# EAGLE schematic PCB2 (EAGLE 8.0.1)
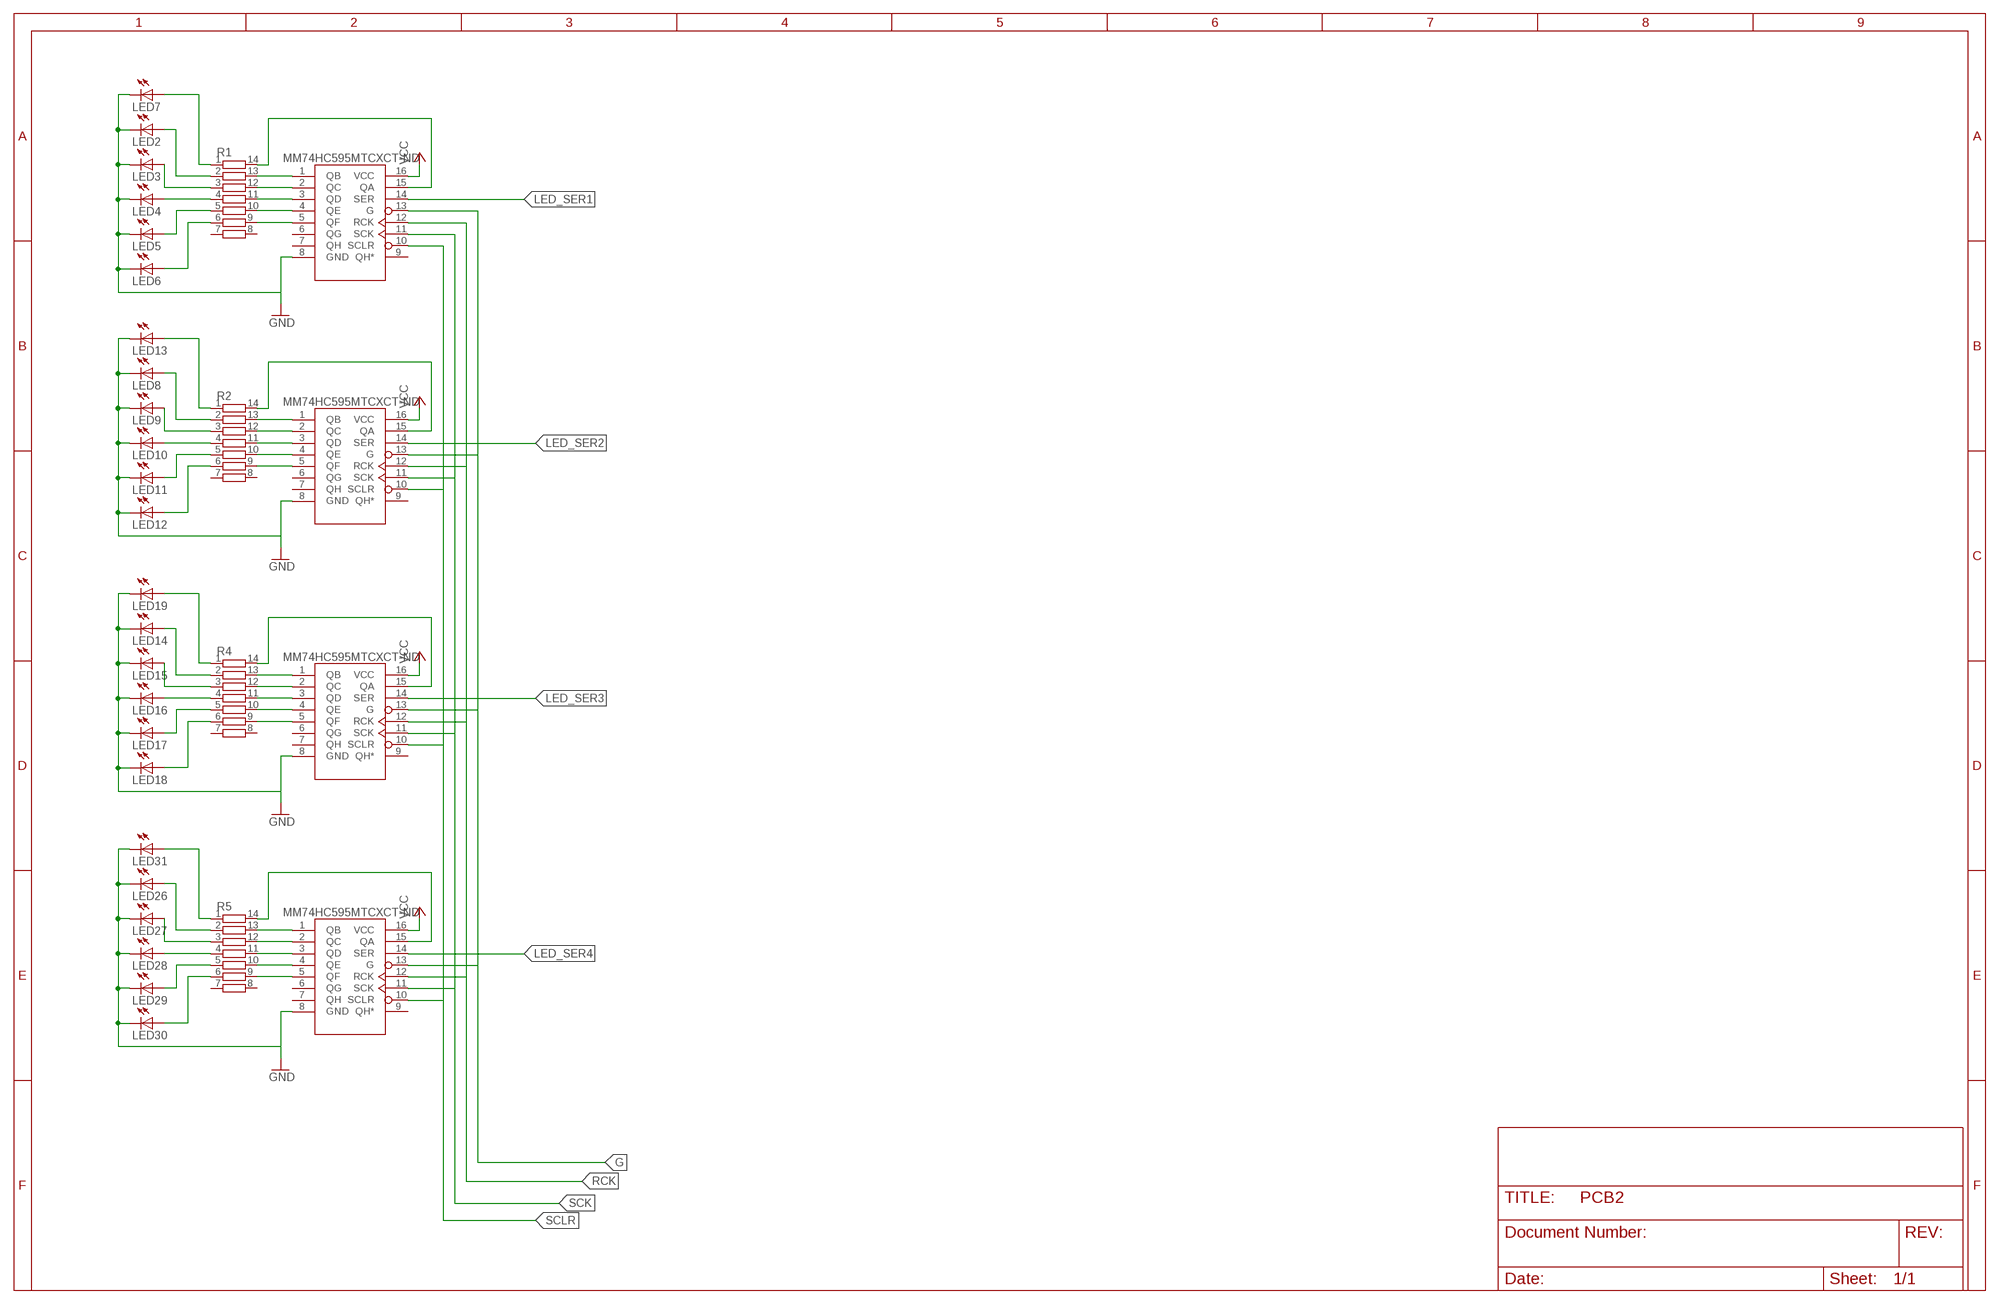
[diagram p0: schematic, sheet 1]

## Parts
LED2  LEDSMT1206  [1206]
LED3  LEDSMT1206  [1206]
LED4  LEDSMT1206  [1206]
LED5  LEDSMT1206  [1206]
LED6  LEDSMT1206  [1206]
LED7  LEDSMT1206  [1206]
LED8  LEDSMT1206  [1206]
LED9  LEDSMT1206  [1206]
LED10  LEDSMT1206  [1206]
LED11  LEDSMT1206  [1206]
LED12  LEDSMT1206  [1206]
LED13  LEDSMT1206  [1206]
LED14  LEDSMT1206  [1206]
LED15  LEDSMT1206  [1206]
LED16  LEDSMT1206  [1206]
LED17  LEDSMT1206  [1206]
LED18  LEDSMT1206  [1206]
LED19  LEDSMT1206  [1206]
LED26  LEDSMT1206  [1206]
LED27  LEDSMT1206  [1206]
LED28  LEDSMT1206  [1206]
LED29  LEDSMT1206  [1206]
LED30  LEDSMT1206  [1206]
LED31  LEDSMT1206  [1206]
R1  4814P-T01  [4814P]
R2  4814P-T01  [4814P]
R4  4814P-T01  [4814P]
R5  4814P-T01  [4814P]
U$1  MM74HC595TSSOP-LD16  [MM74HC595MTCXCT-ND]
U$3  MM74HC595TSSOP-LD16  [MM74HC595MTCXCT-ND]
U$4  MM74HC595TSSOP-LD16  [MM74HC595MTCXCT-ND]
U$5  MM74HC595TSSOP-LD16  [MM74HC595MTCXCT-ND]

## Nets
G: U$4.13(G)
GND: LED2.C LED3.C LED4.C LED5.C LED6.C LED7.C LED8.C LED9.C LED10.C LED11.C LED12.C LED13.C LED14.C LED15.C LED16.C LED17.C LED18.C LED19.C LED26.C LED27.C LED28.C LED29.C LED30.C LED31.C U$1.8(GND) U$3.8(GND) U$4.8(GND) U$5.8(GND)
LED_SER1: U$4.14(SER)
LED_SER2: U$1.14(SER)
LED_SER3: U$3.14(SER)
LED_SER4: U$5.14(SER)
N$1: R1.13 U$4.1(QB)
N$2: R1.12 U$4.2(QC)
N$3: R1.11 U$4.3(QD)
N$4: R1.10 U$4.4(QE)
N$5: R1.9 U$4.5(QF)
N$6: LED7.A R1.1
N$7: R1.14 U$4.15(QA)
N$8: LED2.A R1.2
N$9: LED3.A R1.3
N$10: LED4.A R1.4
N$11: LED5.A R1.5
N$12: LED6.A R1.6
N$13: U$1.13(G)
N$17: U$1.11(SCK)
N$18: U$1.12(RCK)
N$19: R2.13 U$1.1(QB)
N$20: R2.12 U$1.2(QC)
N$21: R2.11 U$1.3(QD)
N$22: R2.10 U$1.4(QE)
N$23: R2.9 U$1.5(QF)
N$24: R2.14 U$1.15(QA)
N$25: LED13.A R2.1
N$26: LED8.A R2.2
N$27: LED9.A R2.3
N$28: LED10.A R2.4
N$29: LED11.A R2.5
N$30: LED12.A R2.6
N$31: U$3.13(G)
N$33: U$3.11(SCK)
N$34: U$3.12(RCK)
N$35: R4.13 U$3.1(QB)
N$36: R4.12 U$3.2(QC)
N$37: R4.11 U$3.3(QD)
N$38: R4.10 U$3.4(QE)
N$39: R4.9 U$3.5(QF)
N$40: R4.14 U$3.15(QA)
N$41: LED19.A R4.1
N$43: LED14.A R4.2
N$44: LED15.A R4.3
N$46: LED16.A R4.4
N$47: LED17.A R4.5
N$49: LED18.A R4.6
N$50: U$5.13(G)
N$53: U$5.11(SCK)
N$54: U$5.12(RCK)
N$60: R5.13 U$5.1(QB)
N$61: R5.12 U$5.2(QC)
N$62: R5.11 U$5.3(QD)
N$63: R5.10 U$5.4(QE)
N$64: R5.9 U$5.5(QF)
N$66: R5.14 U$5.15(QA)
N$67: LED31.A R5.1
N$68: LED26.A R5.2
N$69: LED27.A R5.3
N$70: LED28.A R5.4
N$71: LED29.A R5.5
N$72: LED30.A R5.6
RCK: U$4.12(RCK)
SCK: U$4.11(SCK)
SCLR: U$1.10(SCLR) U$3.10(SCLR) U$4.10(SCLR) U$5.10(SCLR)
VCC: U$1.16(VCC) U$3.16(VCC) U$4.16(VCC) U$5.16(VCC)
Unconnected: R1.7 R1.8 R2.7 R2.8 R4.7 R4.8 R5.7 R5.8 U$1.6(QG) U$1.7(QH) U$1.9(QH*) U$3.6(QG) U$3.7(QH) U$3.9(QH*) U$4.6(QG) U$4.7(QH) U$4.9(QH*) U$5.6(QG) U$5.7(QH) U$5.9(QH*)

## Library data of the parts
LED2-LED19 LED26-LED31 = led:LED: LED OSRAM: - CHIPLED LG R971, LG N971, LY N971, LG Q971, LY Q971, LO R971, LY R971 LH N974, LH R974 LS Q976, LO Q976, LY Q976 LO Q996 - Hyper CHIPLED LW Q18S LB Q993, LB Q99A, LB R99A - SideLED LS A670, LO A670, LY A670, LG A670, LP A670 LB A673, LV A673, LT A673, LW A673 LH A674 LY A675 LS A676, LA A676, LO A676, LY A676, LW A676 LS A679, LY A679, LG A679 - Hyper Micro SIDELED® LS Y876, LA Y876, LO Y876, LY Y876 LT Y87S - SmartLED LW L88C, LW L88S LB L89C, LB L89S, LG L890 LS L89K, LO L89K, LY L89K LS L896, LA L896, LO L896, LY L896 - TOPLED LS T670, LO T670, LY T670, LG T670, LP T670 LSG T670, LSP T670, LSY T670, LOP T670, LYG T670 LG T671, LOG T671, LSG T671 LB T673, LV T673, LT T673, LW T673 LH T674 LS T676, LA T676, LO T676, LY T676, LB T676, LH T676, LSB T676, LW T676 LB T67C, LV T67C, LT T67C, LS T67K, LO T67K, LY T67K, LW E67C LS E67B, LA E67B, LO E67B, LY E67B, LB E67C, LV E67C, LT E67C LW T67C LS T679, LY T679, LG T679 LS T770, LO T770, LY T770, LG T770, LP T770 LB T773, LV T773, LT T773, LW T773 LH T774 LS E675, LA E675, LY E675, LS T675 LS T776, LA T776, LO T776, LY T776, LB T776 LHGB T686 LT T68C, LB T68C - Hyper Mini TOPLED® LB M676 - Mini TOPLED Santana® LG M470 LS M47K, LO M47K, LY M47K Source: http://www.osram.convergy.de LUXEON: - LUMILED® LXK2-PW12-R00, LXK2-PW12-S00, LXK2-PW14-U00, LXK2-PW14-V00 LXK2-PM12-R00, LXK2-PM12-S00, LXK2-PM14-U00 LXK2-PE12-Q00, LXK2-PE12-R00, LXK2-PE12-S00, LXK2-PE14-T00, LXK2-PE14-U00 LXK2-PB12-K00, LXK2-PB12-L00, LXK2-PB12-M00, LXK2-PB14-N00, LXK2-PB14-P00, LXK2-PB14-Q00 LXK2-PR12-L00, LXK2-PR12-M00, LXK2-PR14-Q00, LXK2-PR14-R00 LXK2-PD12-Q00, LXK2-PD12-R00, LXK2-PD12-S00 LXK2-PH12-R00, LXK2-PH12-S00 LXK2-PL12-P00, LXK2-PL12-Q00, LXK2-PL12-R00 Source: www.luxeon.com KINGBRIGHT: KA-3528ASYC Source: www.kingbright.com
R1 R2 R4 R5 = resistor-bourns:4814P-T01: BOURNS RESISTOR NETWORK; MF: BOURNS, INC.; MPN: 4814P-T01-104LF; OC_FARNELL: 9357386; OC_NEWARK: 33K0526
U$1 U$3-U$5 = ECE477_Guitutar:MM74HC595